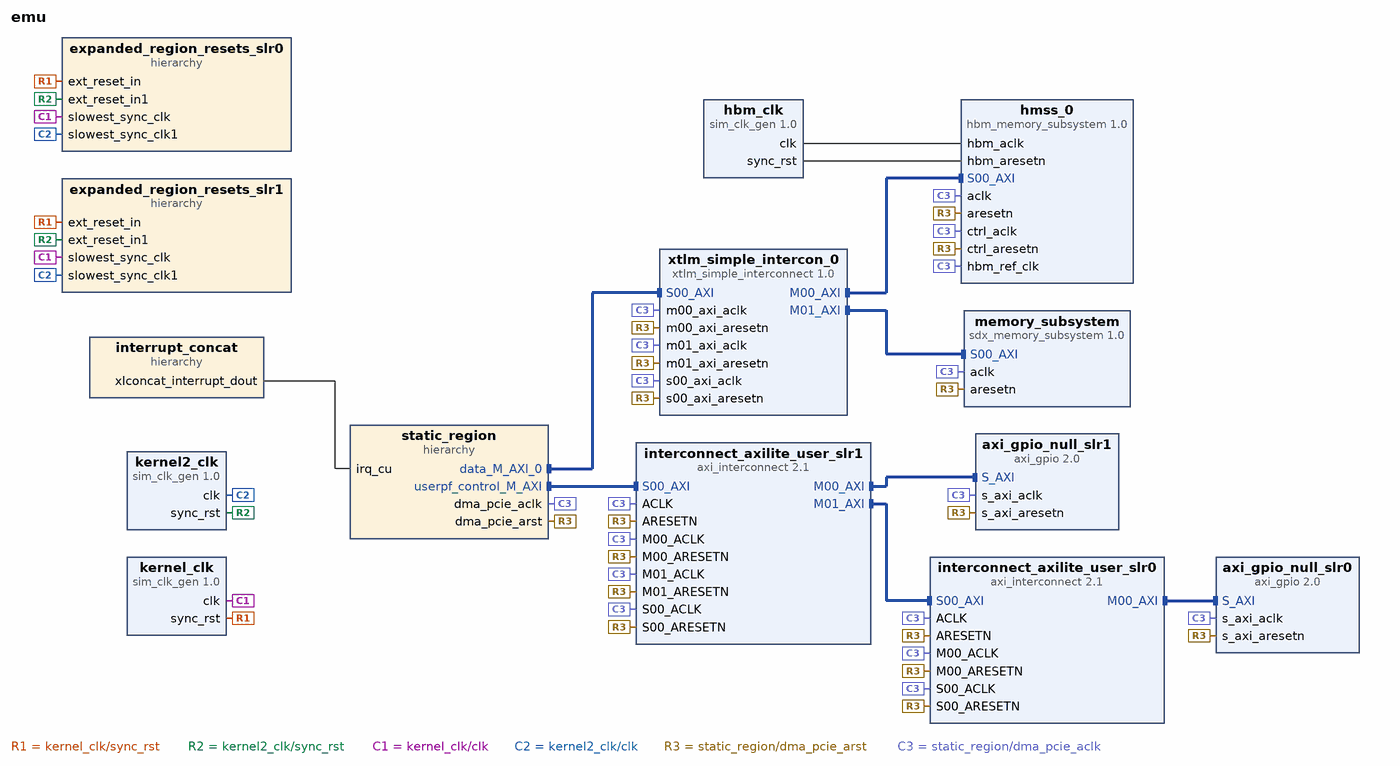
[diagram p0: block diagram of the top level]
# Vivado block design emu, xcu50-fsvh2104-2-e, Vivado 2019.2.1
create_bd_design emu

create_bd_cell -type hier static_region
create_bd_cell -type ip -vlnv xilinx.com:ip:axi_interconnect:2.1 interconnect_axilite_user_slr0
set_property -dict [list \
  CONFIG.M01_HAS_REGSLICE 1 \
  CONFIG.NUM_MI 1 \
  CONFIG.NUM_SI 1 \
  CONFIG.SLR_ASSIGNMENTS SLR0 \
] [get_bd_cells interconnect_axilite_user_slr0]
create_bd_cell -type ip -vlnv xilinx.com:ip:axi_interconnect:2.1 interconnect_axilite_user_slr1
set_property -dict [list \
  CONFIG.M01_HAS_REGSLICE 1 \
  CONFIG.NUM_MI 2 \
  CONFIG.NUM_SI 1 \
  CONFIG.SLR_ASSIGNMENTS SLR1 \
] [get_bd_cells interconnect_axilite_user_slr1]
create_bd_cell -type ip -vlnv xilinx.com:ip:sim_clk_gen:1.0 kernel2_clk
set_property -dict {CONFIG.FREQ_HZ 500000000} [get_bd_cells kernel2_clk]
create_bd_cell -type ip -vlnv xilinx.com:ip:sim_clk_gen:1.0 kernel_clk
set_property -dict {CONFIG.FREQ_HZ 300000000} [get_bd_cells kernel_clk]
create_bd_cell -type hier expanded_region_resets_slr0
create_bd_cell -type hier expanded_region_resets_slr1
create_bd_cell -type ip -vlnv xilinx.com:ip:axi_gpio:2.0 axi_gpio_null_slr0
create_bd_cell -type ip -vlnv xilinx.com:ip:axi_gpio:2.0 axi_gpio_null_slr1
create_bd_cell -type ip -vlnv xilinx.com:xilinx:xtlm_simple_interconnect:1.0 xtlm_simple_intercon_0
set_property -dict [list \
  CONFIG.C_ADDR_RANGES 1 \
  CONFIG.C_M00_A00_ADDR_RANGE 0x0000000200000000 \
  CONFIG.C_M00_A00_BASE_ADDRESS 0x0000000000000000 \
  CONFIG.C_M00_AXI_ADDR_WIDTH 64 \
  CONFIG.C_M01_A00_ADDR_RANGE 0x0000000002000000 \
  CONFIG.C_M01_A00_BASE_ADDRESS 0x0000000200000000 \
  CONFIG.C_M01_AXI_ADDR_WIDTH 64 \
  CONFIG.C_M01_AXI_DATA_WIDTH 32 \
  CONFIG.C_NUM_MI 2 \
  CONFIG.C_S00_AXI_ADDR_WIDTH 64 \
  CONFIG.C_S00_AXI_DATA_WIDTH 32 \
] [get_bd_cells xtlm_simple_intercon_0]
create_bd_cell -type ip -vlnv xilinx.com:ip:sdx_memory_subsystem:1.0 memory_subsystem
set_property -dict [list \
  CONFIG.ADVANCED_PROPERTIES {resource_map_replication {S00_AXI {}} resource_access_constraints {S00_AXI {PLRAM_MEM00 PLRAM_MEM01 PLRAM_MEM02 PLRAM_MEM03}} plram_specifications {{ SIZE 128K AXI_DATA_WIDTH 512 SLR_ASSIGNMENT SLR0 } { SIZE 128K AXI_DATA_WIDTH 512 SLR_ASSIGNMENT SLR0 } { SIZE 128K AXI_DATA_WIDTH 512 SLR_ASSIGNMENT SLR1 } { SIZE 128K AXI_DATA_WIDTH 512 SLR_ASSIGNMENT SLR1 }} __temp_dsa_info {excluded_board_components {} axi_passthrough {} sim_props {plram_0 {offset 0x200000000 range 0x20000 slr SLR0 passthrough no} plram_1 {offset 0x200400000 range 0x20000 slr SLR0 passthrough no} plram_2 {offset 0x201000000 range 0x20000 slr SLR1 passthrough no} plram_3 {offset 0x201400000 range 0x20000 slr SLR1 passthrough no}}}} \
  CONFIG.NUM_CLKS 1 \
  CONFIG.NUM_SI 1 \
] [get_bd_cells memory_subsystem]
create_bd_cell -type ip -vlnv xilinx.com:ip:sim_clk_gen:1.0 hbm_clk
set_property -dict {CONFIG.FREQ_HZ 450} [get_bd_cells hbm_clk]
create_bd_cell -type ip -vlnv xilinx.com:ip:hbm_memory_subsystem:1.0 hmss_0
set_property -dict {CONFIG.S00_SLR SLR0 CONFIG.SIM_EN true} [get_bd_cells hmss_0]
create_bd_cell -type hier interrupt_concat

# ---- hierarchy /static_region ----
current_bd_instance /static_region
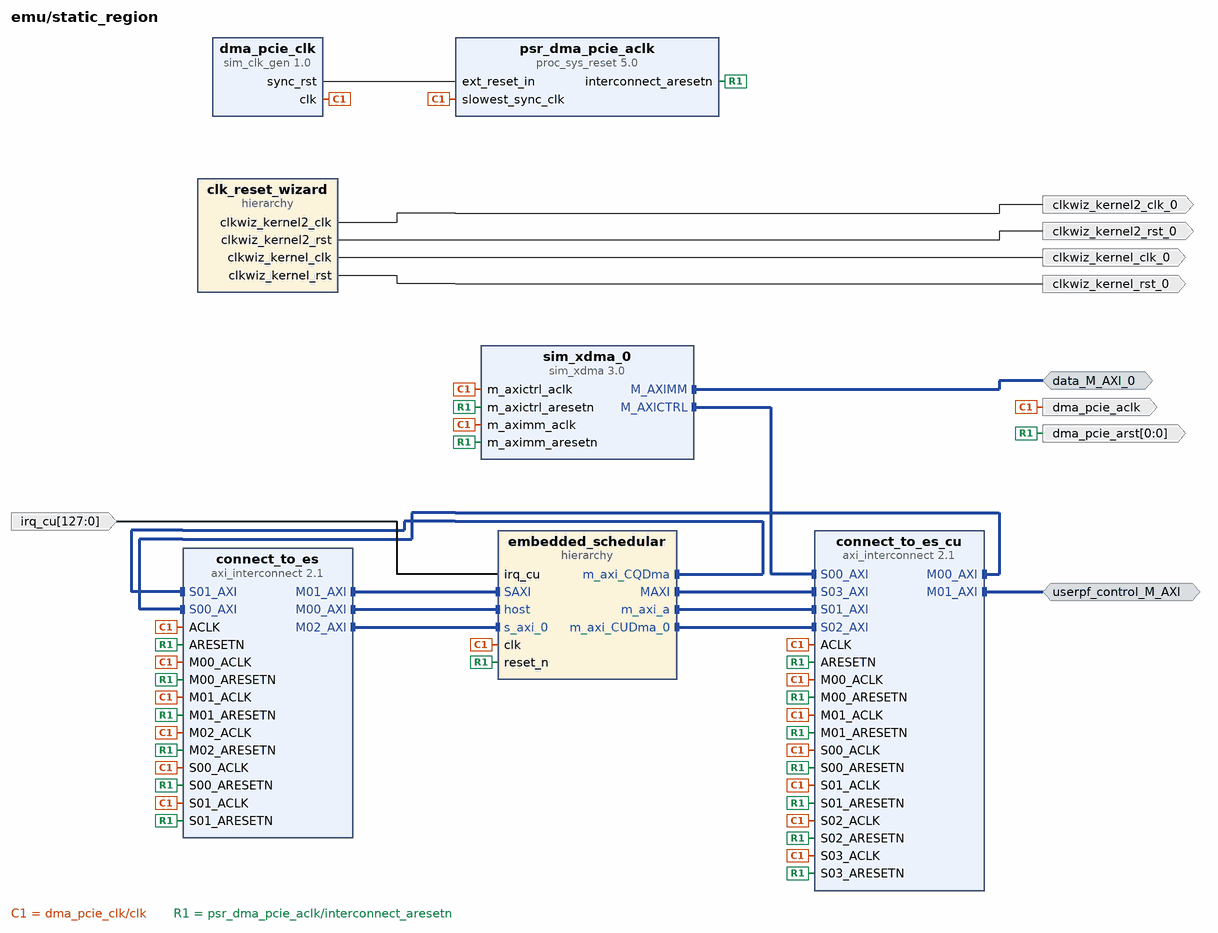
[diagram p1: block diagram inside /static_region]
create_bd_intf_pin -mode Master -vlnv xilinx.com:interface:aximm_rtl:1.0 data_M_AXI_0
create_bd_intf_pin -mode Master -vlnv xilinx.com:interface:aximm_rtl:1.0 userpf_control_M_AXI
create_bd_pin -dir O -type clk clkwiz_kernel2_clk_0
create_bd_pin -dir O -type clk clkwiz_kernel_clk_0
create_bd_pin -dir O -type rst clkwiz_kernel2_rst_0
create_bd_pin -dir O -type rst clkwiz_kernel_rst_0
create_bd_pin -dir O -type clk dma_pcie_aclk
create_bd_pin -dir I -from 127 -to 0 irq_cu
create_bd_pin -dir O -from 0 -to 0 -type rst dma_pcie_arst

create_bd_cell -type hier clk_reset_wizard
create_bd_cell -type ip -vlnv xilinx.com:ip:axi_interconnect:2.1 connect_to_es
set_property -dict {CONFIG.NUM_MI 3 CONFIG.NUM_SI 2} [get_bd_cells connect_to_es]
create_bd_cell -type ip -vlnv xilinx.com:ip:axi_interconnect:2.1 connect_to_es_cu
set_property -dict {CONFIG.NUM_MI 2 CONFIG.NUM_SI 4} [get_bd_cells connect_to_es_cu]
create_bd_cell -type ip -vlnv xilinx.com:ip:sim_clk_gen:1.0 dma_pcie_clk
set_property -dict {CONFIG.FREQ_HZ 300000000.0} [get_bd_cells dma_pcie_clk]
create_bd_cell -type hier embedded_schedular
create_bd_cell -type ip -vlnv xilinx.com:ip:proc_sys_reset:5.0 psr_dma_pcie_aclk
create_bd_cell -type ip -vlnv xilinx.com:xilinx:sim_xdma:3.0 sim_xdma_0
set_property -dict [list \
  CONFIG.C_M_AXICTRL_ADDR_WIDTH 64 \
  CONFIG.C_M_AXICTRL_DATA_WIDTH 32 \
  CONFIG.C_M_AXIMM_ADDR_WIDTH 64 \
  CONFIG.C_M_AXIMM_ARUSER_WIDTH 32 \
  CONFIG.C_M_AXIMM_AWUSER_WIDTH 32 \
  CONFIG.C_M_AXIMM_DATA_WIDTH 32 \
] [get_bd_cells sim_xdma_0]

# ---- hierarchy /static_region/clk_reset_wizard ----
current_bd_instance /static_region/clk_reset_wizard
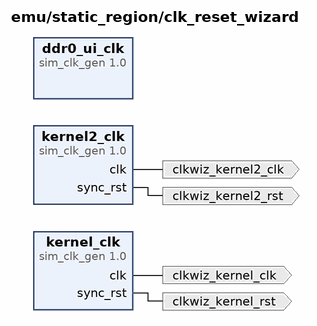
[diagram p2: block diagram inside /static_region/clk_reset_wizard]
create_bd_pin -dir O -type rst clkwiz_kernel2_rst
create_bd_pin -dir O -type rst clkwiz_kernel_rst
create_bd_pin -dir O -type clk clkwiz_kernel2_clk
create_bd_pin -dir O -type clk clkwiz_kernel_clk

create_bd_cell -type ip -vlnv xilinx.com:ip:sim_clk_gen:1.0 ddr0_ui_clk
set_property -dict {CONFIG.FREQ_HZ 300120048} [get_bd_cells ddr0_ui_clk]
create_bd_cell -type ip -vlnv xilinx.com:ip:sim_clk_gen:1.0 kernel2_clk
set_property -dict {CONFIG.FREQ_HZ 500000000} [get_bd_cells kernel2_clk]
create_bd_cell -type ip -vlnv xilinx.com:ip:sim_clk_gen:1.0 kernel_clk
set_property -dict {CONFIG.FREQ_HZ 300000000} [get_bd_cells kernel_clk]

# ---- hierarchy /static_region/embedded_schedular ----
current_bd_instance /static_region/embedded_schedular
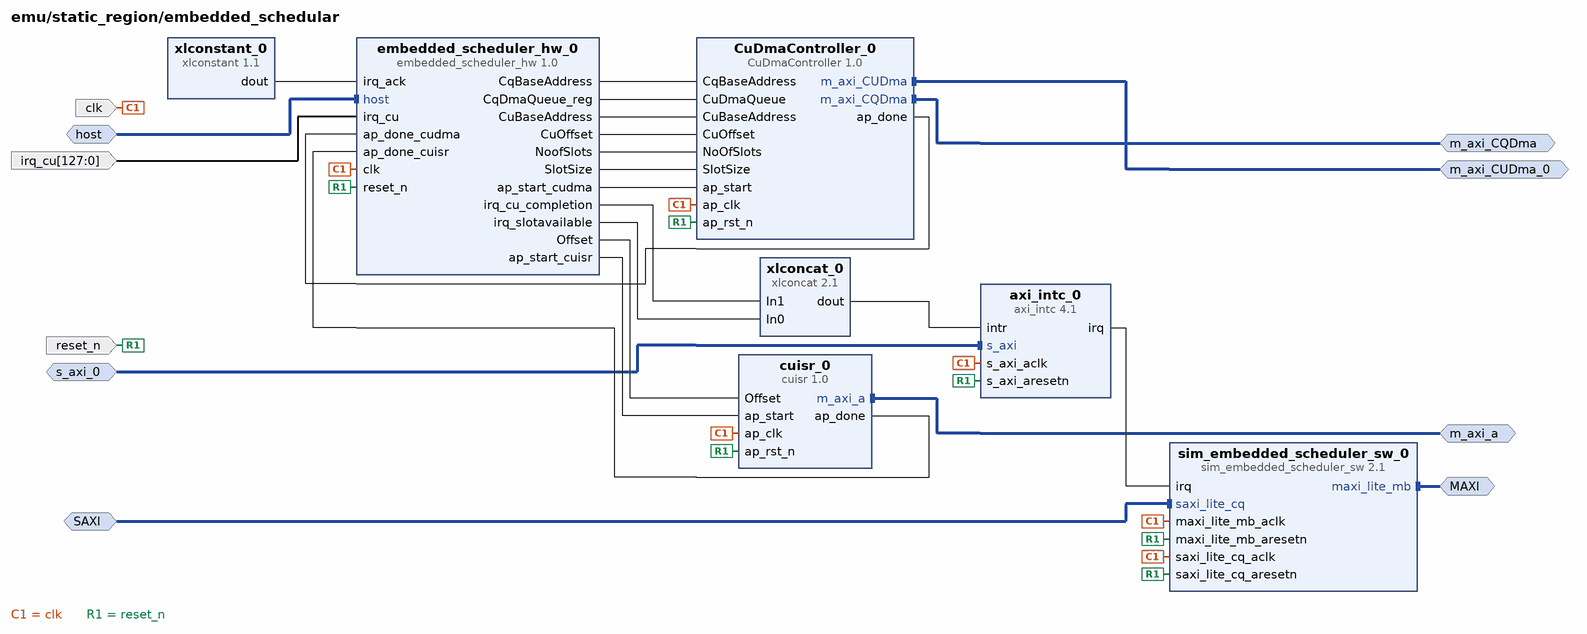
[diagram p3: block diagram inside /static_region/embedded_schedular]
create_bd_intf_pin -mode Master -vlnv xilinx.com:interface:aximm_rtl:1.0 MAXI
create_bd_intf_pin -mode Slave -vlnv xilinx.com:interface:aximm_rtl:1.0 SAXI
create_bd_intf_pin -mode Slave -vlnv xilinx.com:interface:aximm_rtl:1.0 host
create_bd_intf_pin -mode Master -vlnv xilinx.com:interface:aximm_rtl:1.0 m_axi_CQDma
create_bd_intf_pin -mode Master -vlnv xilinx.com:interface:aximm_rtl:1.0 m_axi_CUDma_0
create_bd_intf_pin -mode Master -vlnv xilinx.com:interface:aximm_rtl:1.0 m_axi_a
create_bd_intf_pin -mode Slave -vlnv xilinx.com:interface:aximm_rtl:1.0 s_axi_0
create_bd_pin -dir I -type clk clk
create_bd_pin -dir I -from 127 -to 0 irq_cu
create_bd_pin -dir I -type rst reset_n

create_bd_cell -type ip -vlnv xilinx:hls:CuDmaController:1.0 CuDmaController_0
create_bd_cell -type ip -vlnv xilinx.com:ip:axi_intc:4.1 axi_intc_0
set_property -dict [list \
  CONFIG.C_HAS_FAST 0 \
  CONFIG.C_IRQ_ACTIVE 1 \
  CONFIG.C_IRQ_IS_LEVEL 1 \
  CONFIG.C_KIND_OF_INTR 0xFFFFFFFC \
  CONFIG.C_KIND_OF_LVL 0xFFFFFFFF \
] [get_bd_cells axi_intc_0]
create_bd_cell -type ip -vlnv xilinx:hls:cuisr:1.0 cuisr_0
create_bd_cell -type ip -vlnv xilinx.com:user:embedded_scheduler_hw:1.0 embedded_scheduler_hw_0
create_bd_cell -type ip -vlnv xilinx.com:xilinx:sim_embedded_scheduler_sw:2.1 sim_embedded_scheduler_sw_0
create_bd_cell -type ip -vlnv xilinx.com:ip:xlconcat:2.1 xlconcat_0
create_bd_cell -type ip -vlnv xilinx.com:ip:xlconstant:1.1 xlconstant_0
set_property -dict {CONFIG.CONST_VAL 0 CONFIG.CONST_WIDTH 16} [get_bd_cells xlconstant_0]

# ---- hierarchy /expanded_region_resets_slr0 ----
current_bd_instance /expanded_region_resets_slr0
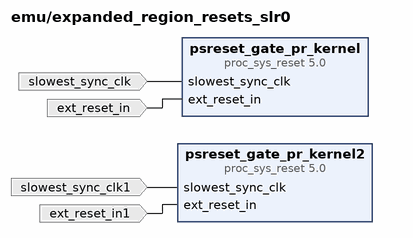
[diagram p4: block diagram inside /expanded_region_resets_slr0]
create_bd_pin -dir I -type clk slowest_sync_clk
create_bd_pin -dir I -type rst ext_reset_in
create_bd_pin -dir I -type clk slowest_sync_clk1
create_bd_pin -dir I -type rst ext_reset_in1

create_bd_cell -type ip -vlnv xilinx.com:ip:proc_sys_reset:5.0 psreset_gate_pr_kernel
set_property -dict {CONFIG.SLR_ASSIGNMENTS SLR0} [get_bd_cells psreset_gate_pr_kernel]
create_bd_cell -type ip -vlnv xilinx.com:ip:proc_sys_reset:5.0 psreset_gate_pr_kernel2
set_property -dict {CONFIG.SLR_ASSIGNMENTS SLR0} [get_bd_cells psreset_gate_pr_kernel2]

# ---- hierarchy /expanded_region_resets_slr1 ----
current_bd_instance /expanded_region_resets_slr1
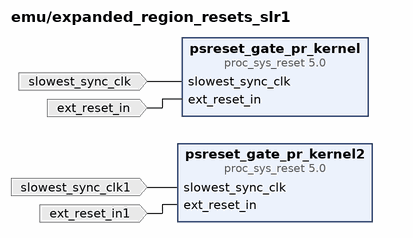
[diagram p5: block diagram inside /expanded_region_resets_slr1]
create_bd_pin -dir I -type clk slowest_sync_clk
create_bd_pin -dir I -type rst ext_reset_in
create_bd_pin -dir I -type clk slowest_sync_clk1
create_bd_pin -dir I -type rst ext_reset_in1

create_bd_cell -type ip -vlnv xilinx.com:ip:proc_sys_reset:5.0 psreset_gate_pr_kernel
set_property -dict {CONFIG.SLR_ASSIGNMENTS SLR1} [get_bd_cells psreset_gate_pr_kernel]
create_bd_cell -type ip -vlnv xilinx.com:ip:proc_sys_reset:5.0 psreset_gate_pr_kernel2
set_property -dict {CONFIG.SLR_ASSIGNMENTS SLR1} [get_bd_cells psreset_gate_pr_kernel2]

# ---- hierarchy /interrupt_concat ----
current_bd_instance /interrupt_concat
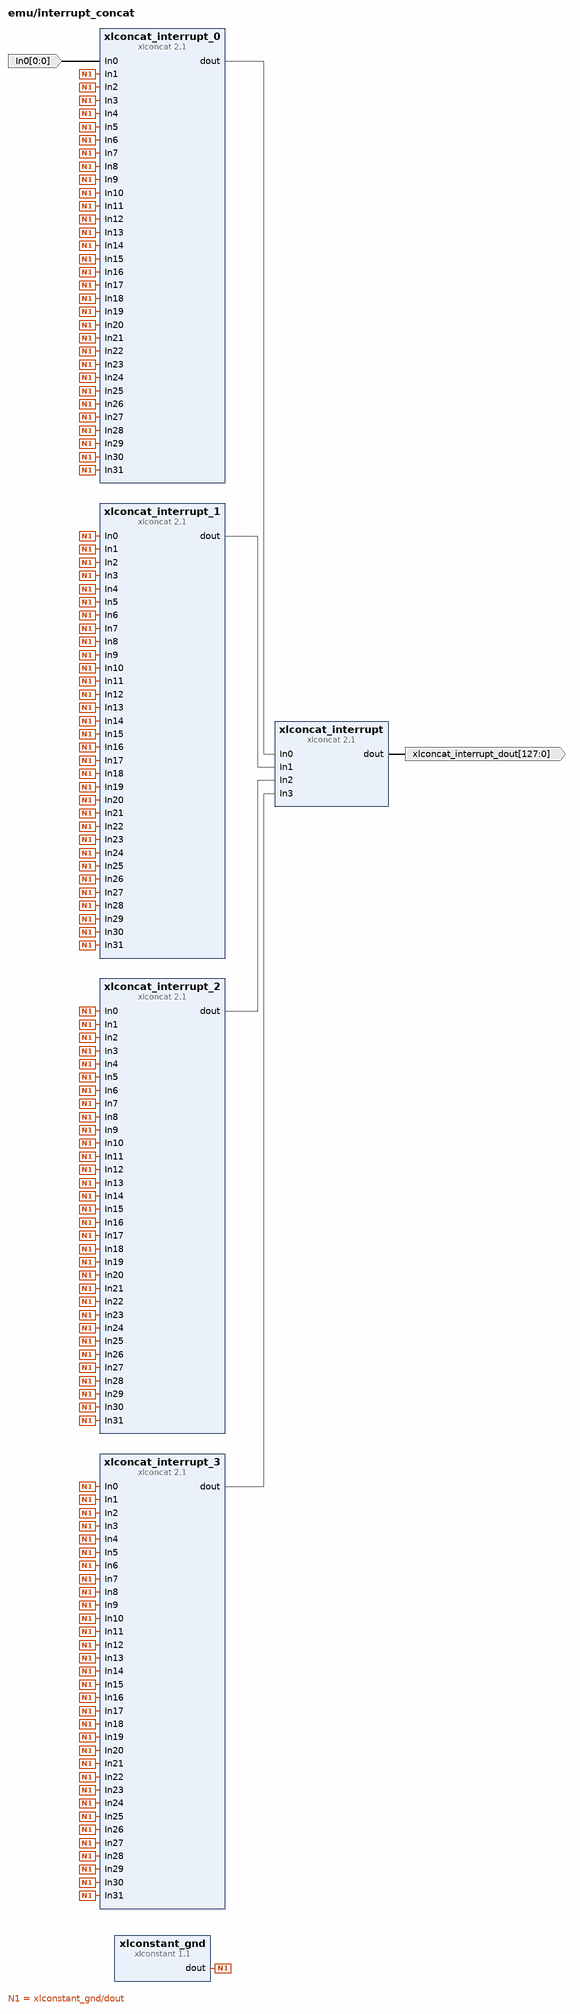
[diagram p6: block diagram inside /interrupt_concat]
create_bd_pin -dir I -from 0 -to 0 In0
create_bd_pin -dir O -from 127 -to 0 xlconcat_interrupt_dout

create_bd_cell -type ip -vlnv xilinx.com:ip:xlconcat:2.1 xlconcat_interrupt
set_property -dict {CONFIG.NUM_PORTS 4} [get_bd_cells xlconcat_interrupt]
create_bd_cell -type ip -vlnv xilinx.com:ip:xlconcat:2.1 xlconcat_interrupt_0
set_property -dict {CONFIG.NUM_PORTS 32} [get_bd_cells xlconcat_interrupt_0]
create_bd_cell -type ip -vlnv xilinx.com:ip:xlconcat:2.1 xlconcat_interrupt_1
set_property -dict {CONFIG.NUM_PORTS 32} [get_bd_cells xlconcat_interrupt_1]
create_bd_cell -type ip -vlnv xilinx.com:ip:xlconcat:2.1 xlconcat_interrupt_2
set_property -dict {CONFIG.NUM_PORTS 32} [get_bd_cells xlconcat_interrupt_2]
create_bd_cell -type ip -vlnv xilinx.com:ip:xlconcat:2.1 xlconcat_interrupt_3
set_property -dict {CONFIG.NUM_PORTS 32} [get_bd_cells xlconcat_interrupt_3]
create_bd_cell -type ip -vlnv xilinx.com:ip:xlconstant:1.1 xlconstant_gnd
set_property -dict {CONFIG.CONST_VAL 0} [get_bd_cells xlconstant_gnd]

# ---- connections ----

current_bd_instance /static_region
connect_bd_intf_net [get_bd_intf_pins connect_to_es/M01_AXI] [get_bd_intf_pins embedded_schedular/SAXI]
connect_bd_intf_net [get_bd_intf_pins connect_to_es_cu/S03_AXI] [get_bd_intf_pins embedded_schedular/MAXI]
connect_bd_intf_net [get_bd_intf_pins connect_to_es/S01_AXI] [get_bd_intf_pins embedded_schedular/m_axi_CQDma]
connect_bd_intf_net [get_bd_intf_pins userpf_control_M_AXI] [get_bd_intf_pins connect_to_es_cu/M01_AXI]
connect_bd_intf_net [get_bd_intf_pins connect_to_es_cu/S01_AXI] [get_bd_intf_pins embedded_schedular/m_axi_a]
connect_bd_intf_net [get_bd_intf_pins connect_to_es_cu/S00_AXI] [get_bd_intf_pins sim_xdma_0/M_AXICTRL]
connect_bd_intf_net [get_bd_intf_pins connect_to_es/M00_AXI] [get_bd_intf_pins embedded_schedular/host]
connect_bd_intf_net [get_bd_intf_pins connect_to_es/M02_AXI] [get_bd_intf_pins embedded_schedular/s_axi_0]
connect_bd_intf_net -intf_net data_M_AXI_0_1_conn [get_bd_intf_pins data_M_AXI_0] [get_bd_intf_pins sim_xdma_0/M_AXIMM]
connect_bd_intf_net [get_bd_intf_pins connect_to_es/S00_AXI] [get_bd_intf_pins connect_to_es_cu/M00_AXI]
connect_bd_intf_net [get_bd_intf_pins connect_to_es_cu/S02_AXI] [get_bd_intf_pins embedded_schedular/m_axi_CUDma_0]
connect_bd_net [get_bd_pins clk_reset_wizard/clkwiz_kernel2_clk] [get_bd_pins clkwiz_kernel2_clk_0]
connect_bd_net [get_bd_pins clk_reset_wizard/clkwiz_kernel_clk] [get_bd_pins clkwiz_kernel_clk_0]
connect_bd_net [get_bd_pins clk_reset_wizard/clkwiz_kernel2_rst] [get_bd_pins clkwiz_kernel2_rst_0]
connect_bd_net [get_bd_pins clk_reset_wizard/clkwiz_kernel_rst] [get_bd_pins clkwiz_kernel_rst_0]
connect_bd_net -net pcie_dma_aclk [get_bd_pins dma_pcie_clk/clk] \
  [get_bd_pins dma_pcie_aclk] [get_bd_pins connect_to_es/ACLK] [get_bd_pins connect_to_es/M00_ACLK] \
  [get_bd_pins connect_to_es/M01_ACLK] [get_bd_pins connect_to_es/M02_ACLK] [get_bd_pins connect_to_es/S00_ACLK] \
  [get_bd_pins connect_to_es/S01_ACLK] [get_bd_pins connect_to_es_cu/ACLK] [get_bd_pins connect_to_es_cu/M00_ACLK] \
  [get_bd_pins connect_to_es_cu/M01_ACLK] [get_bd_pins connect_to_es_cu/S00_ACLK] [get_bd_pins connect_to_es_cu/S01_ACLK] \
  [get_bd_pins connect_to_es_cu/S02_ACLK] [get_bd_pins connect_to_es_cu/S03_ACLK] [get_bd_pins embedded_schedular/clk] \
  [get_bd_pins psr_dma_pcie_aclk/slowest_sync_clk] [get_bd_pins sim_xdma_0/m_axictrl_aclk] \
  [get_bd_pins sim_xdma_0/m_aximm_aclk]
connect_bd_net -net pcie_dma [get_bd_pins dma_pcie_clk/sync_rst] [get_bd_pins psr_dma_pcie_aclk/ext_reset_in]
connect_bd_net [get_bd_pins irq_cu] [get_bd_pins embedded_schedular/irq_cu]
connect_bd_net -net psr_dma_pcie_aclk_mb_reset [get_bd_pins psr_dma_pcie_aclk/interconnect_aresetn] \
  [get_bd_pins dma_pcie_arst] [get_bd_pins connect_to_es/ARESETN] [get_bd_pins connect_to_es/M00_ARESETN] \
  [get_bd_pins connect_to_es/M01_ARESETN] [get_bd_pins connect_to_es/M02_ARESETN] [get_bd_pins connect_to_es/S00_ARESETN] \
  [get_bd_pins connect_to_es/S01_ARESETN] [get_bd_pins connect_to_es_cu/ARESETN] [get_bd_pins connect_to_es_cu/M00_ARESETN] \
  [get_bd_pins connect_to_es_cu/M01_ARESETN] [get_bd_pins connect_to_es_cu/S00_ARESETN] \
  [get_bd_pins connect_to_es_cu/S01_ARESETN] [get_bd_pins connect_to_es_cu/S02_ARESETN] \
  [get_bd_pins connect_to_es_cu/S03_ARESETN] [get_bd_pins embedded_schedular/reset_n] \
  [get_bd_pins sim_xdma_0/m_axictrl_aresetn] [get_bd_pins sim_xdma_0/m_aximm_aresetn]

current_bd_instance /static_region/clk_reset_wizard
connect_bd_net [get_bd_pins kernel2_clk/sync_rst] [get_bd_pins clkwiz_kernel2_rst]
connect_bd_net [get_bd_pins kernel_clk/sync_rst] [get_bd_pins clkwiz_kernel_rst]
connect_bd_net [get_bd_pins kernel_clk/clk] [get_bd_pins clkwiz_kernel_clk]
connect_bd_net [get_bd_pins kernel2_clk/clk] [get_bd_pins clkwiz_kernel2_clk]

current_bd_instance /static_region/embedded_schedular
connect_bd_intf_net [get_bd_intf_pins MAXI] [get_bd_intf_pins sim_embedded_scheduler_sw_0/maxi_lite_mb]
connect_bd_intf_net [get_bd_intf_pins m_axi_a] [get_bd_intf_pins cuisr_0/m_axi_a]
connect_bd_intf_net [get_bd_intf_pins SAXI] [get_bd_intf_pins sim_embedded_scheduler_sw_0/saxi_lite_cq]
connect_bd_intf_net [get_bd_intf_pins m_axi_CUDma_0] [get_bd_intf_pins CuDmaController_0/m_axi_CUDma]
connect_bd_intf_net -intf_net S01_AXI_1 [get_bd_intf_pins m_axi_CQDma] [get_bd_intf_pins CuDmaController_0/m_axi_CQDma]
connect_bd_intf_net [get_bd_intf_pins s_axi_0] [get_bd_intf_pins axi_intc_0/s_axi]
connect_bd_intf_net -intf_net axi_interconnect_0_M00_AXI [get_bd_intf_pins host] [get_bd_intf_pins embedded_scheduler_hw_0/host]
connect_bd_net [get_bd_pins CuDmaController_0/ap_done] [get_bd_pins embedded_scheduler_hw_0/ap_done_cudma]
connect_bd_net [get_bd_pins axi_intc_0/irq] [get_bd_pins sim_embedded_scheduler_sw_0/irq]
connect_bd_net [get_bd_pins cuisr_0/ap_done] [get_bd_pins embedded_scheduler_hw_0/ap_done_cuisr]
connect_bd_net -net dma_pcie_aclk_clk [get_bd_pins clk] \
  [get_bd_pins CuDmaController_0/ap_clk] [get_bd_pins axi_intc_0/s_axi_aclk] [get_bd_pins cuisr_0/ap_clk] \
  [get_bd_pins embedded_scheduler_hw_0/clk] [get_bd_pins sim_embedded_scheduler_sw_0/maxi_lite_mb_aclk] \
  [get_bd_pins sim_embedded_scheduler_sw_0/saxi_lite_cq_aclk]
connect_bd_net -net dma_pcie_aclk_sync_rst [get_bd_pins reset_n] \
  [get_bd_pins CuDmaController_0/ap_rst_n] [get_bd_pins axi_intc_0/s_axi_aresetn] [get_bd_pins cuisr_0/ap_rst_n] \
  [get_bd_pins embedded_scheduler_hw_0/reset_n] [get_bd_pins sim_embedded_scheduler_sw_0/maxi_lite_mb_aresetn] \
  [get_bd_pins sim_embedded_scheduler_sw_0/saxi_lite_cq_aresetn]
connect_bd_net [get_bd_pins embedded_scheduler_hw_0/CqBaseAddress] [get_bd_pins CuDmaController_0/CqBaseAddress]
connect_bd_net [get_bd_pins embedded_scheduler_hw_0/CqDmaQueue_reg] [get_bd_pins CuDmaController_0/CuDmaQueue]
connect_bd_net [get_bd_pins embedded_scheduler_hw_0/CuBaseAddress] [get_bd_pins CuDmaController_0/CuBaseAddress]
connect_bd_net [get_bd_pins embedded_scheduler_hw_0/CuOffset] [get_bd_pins CuDmaController_0/CuOffset]
connect_bd_net [get_bd_pins embedded_scheduler_hw_0/NoofSlots] [get_bd_pins CuDmaController_0/NoOfSlots]
connect_bd_net [get_bd_pins embedded_scheduler_hw_0/SlotSize] [get_bd_pins CuDmaController_0/SlotSize]
connect_bd_net -net embedded_scheduler_hw_0_ap_offset_cuisr [get_bd_pins embedded_scheduler_hw_0/Offset] [get_bd_pins cuisr_0/Offset]
connect_bd_net [get_bd_pins embedded_scheduler_hw_0/ap_start_cudma] [get_bd_pins CuDmaController_0/ap_start]
connect_bd_net [get_bd_pins embedded_scheduler_hw_0/ap_start_cuisr] [get_bd_pins cuisr_0/ap_start]
connect_bd_net [get_bd_pins embedded_scheduler_hw_0/irq_cu_completion] [get_bd_pins xlconcat_0/In1]
connect_bd_net [get_bd_pins embedded_scheduler_hw_0/irq_slotavailable] [get_bd_pins xlconcat_0/In0]
connect_bd_net [get_bd_pins irq_cu] [get_bd_pins embedded_scheduler_hw_0/irq_cu]
connect_bd_net [get_bd_pins xlconcat_0/dout] [get_bd_pins axi_intc_0/intr]
connect_bd_net [get_bd_pins xlconstant_0/dout] [get_bd_pins embedded_scheduler_hw_0/irq_ack]

current_bd_instance /expanded_region_resets_slr0
connect_bd_net -net slowest_sync_clk_0_1 [get_bd_pins slowest_sync_clk] [get_bd_pins psreset_gate_pr_kernel/slowest_sync_clk]
connect_bd_net -net ext_reset_in_0_1 [get_bd_pins ext_reset_in] [get_bd_pins psreset_gate_pr_kernel/ext_reset_in]
connect_bd_net -net slowest_sync_clk_2_1 [get_bd_pins slowest_sync_clk1] [get_bd_pins psreset_gate_pr_kernel2/slowest_sync_clk]
connect_bd_net -net ext_reset_in_2_1 [get_bd_pins ext_reset_in1] [get_bd_pins psreset_gate_pr_kernel2/ext_reset_in]

current_bd_instance /expanded_region_resets_slr1
connect_bd_net -net slowest_sync_clk_0_1 [get_bd_pins slowest_sync_clk] [get_bd_pins psreset_gate_pr_kernel/slowest_sync_clk]
connect_bd_net -net ext_reset_in_0_1 [get_bd_pins ext_reset_in] [get_bd_pins psreset_gate_pr_kernel/ext_reset_in]
connect_bd_net -net slowest_sync_clk_2_1 [get_bd_pins slowest_sync_clk1] [get_bd_pins psreset_gate_pr_kernel2/slowest_sync_clk]
connect_bd_net -net ext_reset_in_2_1 [get_bd_pins ext_reset_in1] [get_bd_pins psreset_gate_pr_kernel2/ext_reset_in]

current_bd_instance /interrupt_concat
connect_bd_net -net In0_1 [get_bd_pins In0] [get_bd_pins xlconcat_interrupt_0/In0]
connect_bd_net [get_bd_pins xlconcat_interrupt_0/dout] [get_bd_pins xlconcat_interrupt/In0]
connect_bd_net [get_bd_pins xlconcat_interrupt_1/dout] [get_bd_pins xlconcat_interrupt/In1]
connect_bd_net [get_bd_pins xlconcat_interrupt_2/dout] [get_bd_pins xlconcat_interrupt/In2]
connect_bd_net [get_bd_pins xlconcat_interrupt_3/dout] [get_bd_pins xlconcat_interrupt/In3]
connect_bd_net [get_bd_pins xlconcat_interrupt/dout] [get_bd_pins xlconcat_interrupt_dout]
connect_bd_net [get_bd_pins xlconstant_gnd/dout] \
  [get_bd_pins xlconcat_interrupt_0/In1] [get_bd_pins xlconcat_interrupt_0/In2] [get_bd_pins xlconcat_interrupt_0/In3] \
  [get_bd_pins xlconcat_interrupt_0/In4] [get_bd_pins xlconcat_interrupt_0/In5] [get_bd_pins xlconcat_interrupt_0/In6] \
  [get_bd_pins xlconcat_interrupt_0/In7] [get_bd_pins xlconcat_interrupt_0/In8] [get_bd_pins xlconcat_interrupt_0/In9] \
  [get_bd_pins xlconcat_interrupt_0/In10] [get_bd_pins xlconcat_interrupt_0/In11] [get_bd_pins xlconcat_interrupt_0/In12] \
  [get_bd_pins xlconcat_interrupt_0/In13] [get_bd_pins xlconcat_interrupt_0/In14] [get_bd_pins xlconcat_interrupt_0/In15] \
  [get_bd_pins xlconcat_interrupt_0/In16] [get_bd_pins xlconcat_interrupt_0/In17] [get_bd_pins xlconcat_interrupt_0/In18] \
  [get_bd_pins xlconcat_interrupt_0/In19] [get_bd_pins xlconcat_interrupt_0/In20] [get_bd_pins xlconcat_interrupt_0/In21] \
  [get_bd_pins xlconcat_interrupt_0/In22] [get_bd_pins xlconcat_interrupt_0/In23] [get_bd_pins xlconcat_interrupt_0/In24] \
  [get_bd_pins xlconcat_interrupt_0/In25] [get_bd_pins xlconcat_interrupt_0/In26] [get_bd_pins xlconcat_interrupt_0/In27] \
  [get_bd_pins xlconcat_interrupt_0/In28] [get_bd_pins xlconcat_interrupt_0/In29] [get_bd_pins xlconcat_interrupt_0/In30] \
  [get_bd_pins xlconcat_interrupt_0/In31] [get_bd_pins xlconcat_interrupt_1/In0] [get_bd_pins xlconcat_interrupt_1/In1] \
  [get_bd_pins xlconcat_interrupt_1/In2] [get_bd_pins xlconcat_interrupt_1/In3] [get_bd_pins xlconcat_interrupt_1/In4] \
  [get_bd_pins xlconcat_interrupt_1/In5] [get_bd_pins xlconcat_interrupt_1/In6] [get_bd_pins xlconcat_interrupt_1/In7] \
  [get_bd_pins xlconcat_interrupt_1/In8] [get_bd_pins xlconcat_interrupt_1/In9] [get_bd_pins xlconcat_interrupt_1/In10] \
  [get_bd_pins xlconcat_interrupt_1/In11] [get_bd_pins xlconcat_interrupt_1/In12] [get_bd_pins xlconcat_interrupt_1/In13] \
  [get_bd_pins xlconcat_interrupt_1/In14] [get_bd_pins xlconcat_interrupt_1/In15] [get_bd_pins xlconcat_interrupt_1/In16] \
  [get_bd_pins xlconcat_interrupt_1/In17] [get_bd_pins xlconcat_interrupt_1/In18] [get_bd_pins xlconcat_interrupt_1/In19] \
  [get_bd_pins xlconcat_interrupt_1/In20] [get_bd_pins xlconcat_interrupt_1/In21] [get_bd_pins xlconcat_interrupt_1/In22] \
  [get_bd_pins xlconcat_interrupt_1/In23] [get_bd_pins xlconcat_interrupt_1/In24] [get_bd_pins xlconcat_interrupt_1/In25] \
  [get_bd_pins xlconcat_interrupt_1/In26] [get_bd_pins xlconcat_interrupt_1/In27] [get_bd_pins xlconcat_interrupt_1/In28] \
  [get_bd_pins xlconcat_interrupt_1/In29] [get_bd_pins xlconcat_interrupt_1/In30] [get_bd_pins xlconcat_interrupt_1/In31] \
  [get_bd_pins xlconcat_interrupt_2/In0] [get_bd_pins xlconcat_interrupt_2/In1] [get_bd_pins xlconcat_interrupt_2/In2] \
  [get_bd_pins xlconcat_interrupt_2/In3] [get_bd_pins xlconcat_interrupt_2/In4] [get_bd_pins xlconcat_interrupt_2/In5] \
  [get_bd_pins xlconcat_interrupt_2/In6] [get_bd_pins xlconcat_interrupt_2/In7] [get_bd_pins xlconcat_interrupt_2/In8] \
  [get_bd_pins xlconcat_interrupt_2/In9] [get_bd_pins xlconcat_interrupt_2/In10] [get_bd_pins xlconcat_interrupt_2/In11] \
  [get_bd_pins xlconcat_interrupt_2/In12] [get_bd_pins xlconcat_interrupt_2/In13] [get_bd_pins xlconcat_interrupt_2/In14] \
  [get_bd_pins xlconcat_interrupt_2/In15] [get_bd_pins xlconcat_interrupt_2/In16] [get_bd_pins xlconcat_interrupt_2/In17] \
  [get_bd_pins xlconcat_interrupt_2/In18] [get_bd_pins xlconcat_interrupt_2/In19] [get_bd_pins xlconcat_interrupt_2/In20] \
  [get_bd_pins xlconcat_interrupt_2/In21] [get_bd_pins xlconcat_interrupt_2/In22] [get_bd_pins xlconcat_interrupt_2/In23] \
  [get_bd_pins xlconcat_interrupt_2/In24] [get_bd_pins xlconcat_interrupt_2/In25] [get_bd_pins xlconcat_interrupt_2/In26] \
  [get_bd_pins xlconcat_interrupt_2/In27] [get_bd_pins xlconcat_interrupt_2/In28] [get_bd_pins xlconcat_interrupt_2/In29] \
  [get_bd_pins xlconcat_interrupt_2/In30] [get_bd_pins xlconcat_interrupt_2/In31] [get_bd_pins xlconcat_interrupt_3/In0] \
  [get_bd_pins xlconcat_interrupt_3/In1] [get_bd_pins xlconcat_interrupt_3/In2] [get_bd_pins xlconcat_interrupt_3/In3] \
  [get_bd_pins xlconcat_interrupt_3/In4] [get_bd_pins xlconcat_interrupt_3/In5] [get_bd_pins xlconcat_interrupt_3/In6] \
  [get_bd_pins xlconcat_interrupt_3/In7] [get_bd_pins xlconcat_interrupt_3/In8] [get_bd_pins xlconcat_interrupt_3/In9] \
  [get_bd_pins xlconcat_interrupt_3/In10] [get_bd_pins xlconcat_interrupt_3/In11] [get_bd_pins xlconcat_interrupt_3/In12] \
  [get_bd_pins xlconcat_interrupt_3/In13] [get_bd_pins xlconcat_interrupt_3/In14] [get_bd_pins xlconcat_interrupt_3/In15] \
  [get_bd_pins xlconcat_interrupt_3/In16] [get_bd_pins xlconcat_interrupt_3/In17] [get_bd_pins xlconcat_interrupt_3/In18] \
  [get_bd_pins xlconcat_interrupt_3/In19] [get_bd_pins xlconcat_interrupt_3/In20] [get_bd_pins xlconcat_interrupt_3/In21] \
  [get_bd_pins xlconcat_interrupt_3/In22] [get_bd_pins xlconcat_interrupt_3/In23] [get_bd_pins xlconcat_interrupt_3/In24] \
  [get_bd_pins xlconcat_interrupt_3/In25] [get_bd_pins xlconcat_interrupt_3/In26] [get_bd_pins xlconcat_interrupt_3/In27] \
  [get_bd_pins xlconcat_interrupt_3/In28] [get_bd_pins xlconcat_interrupt_3/In29] [get_bd_pins xlconcat_interrupt_3/In30] \
  [get_bd_pins xlconcat_interrupt_3/In31]

current_bd_instance /
connect_bd_intf_net -intf_net interconnect_axilite_0_M00_AXI [get_bd_intf_pins interconnect_axilite_user_slr0/M00_AXI] [get_bd_intf_pins axi_gpio_null_slr0/S_AXI]
connect_bd_intf_net -intf_net interconnect_axilite_1_M00_AXI [get_bd_intf_pins interconnect_axilite_user_slr1/M00_AXI] [get_bd_intf_pins axi_gpio_null_slr1/S_AXI]
connect_bd_intf_net [get_bd_intf_pins interconnect_axilite_user_slr0/S00_AXI] [get_bd_intf_pins interconnect_axilite_user_slr1/M01_AXI]
connect_bd_intf_net -intf_net hmss_s00_axi [get_bd_intf_pins hmss_0/S00_AXI] [get_bd_intf_pins xtlm_simple_intercon_0/M00_AXI]
connect_bd_intf_net [get_bd_intf_pins interconnect_axilite_user_slr1/S00_AXI] [get_bd_intf_pins static_region/userpf_control_M_AXI]
connect_bd_intf_net [get_bd_intf_pins xtlm_simple_intercon_0/S00_AXI] [get_bd_intf_pins static_region/data_M_AXI_0]
connect_bd_intf_net -intf_net xtlm_simple_intercon_0_M_AXI_1_AXI [get_bd_intf_pins memory_subsystem/S00_AXI] [get_bd_intf_pins xtlm_simple_intercon_0/M01_AXI]
connect_bd_net -net ext_reset_in_0_1 [get_bd_pins kernel_clk/sync_rst] \
  [get_bd_pins expanded_region_resets_slr0/ext_reset_in] [get_bd_pins expanded_region_resets_slr1/ext_reset_in]
connect_bd_net -net ext_reset_in_2_1 [get_bd_pins kernel2_clk/sync_rst] \
  [get_bd_pins expanded_region_resets_slr0/ext_reset_in1] [get_bd_pins expanded_region_resets_slr1/ext_reset_in1]
connect_bd_net -net slowest_sync_clk_0_1 [get_bd_pins kernel_clk/clk] \
  [get_bd_pins expanded_region_resets_slr0/slowest_sync_clk] [get_bd_pins expanded_region_resets_slr1/slowest_sync_clk]
connect_bd_net -net slowest_sync_clk_2_1 [get_bd_pins kernel2_clk/clk] \
  [get_bd_pins expanded_region_resets_slr0/slowest_sync_clk1] [get_bd_pins expanded_region_resets_slr1/slowest_sync_clk1]
connect_bd_net -net ext_reset_in_1_1 [get_bd_pins static_region/dma_pcie_arst] \
  [get_bd_pins xtlm_simple_intercon_0/s00_axi_aresetn] [get_bd_pins xtlm_simple_intercon_0/m00_axi_aresetn] \
  [get_bd_pins hmss_0/aresetn] [get_bd_pins interconnect_axilite_user_slr0/ARESETN] \
  [get_bd_pins interconnect_axilite_user_slr0/M00_ARESETN] [get_bd_pins interconnect_axilite_user_slr0/S00_ARESETN] \
  [get_bd_pins interconnect_axilite_user_slr1/ARESETN] [get_bd_pins interconnect_axilite_user_slr1/M00_ARESETN] \
  [get_bd_pins interconnect_axilite_user_slr1/M01_ARESETN] [get_bd_pins interconnect_axilite_user_slr1/S00_ARESETN] \
  [get_bd_pins axi_gpio_null_slr0/s_axi_aresetn] [get_bd_pins axi_gpio_null_slr1/s_axi_aresetn] \
  [get_bd_pins hmss_0/ctrl_aresetn] [get_bd_pins memory_subsystem/aresetn] \
  [get_bd_pins xtlm_simple_intercon_0/m01_axi_aresetn]
connect_bd_net -net slowest_sync_clk_1_1 [get_bd_pins static_region/dma_pcie_aclk] \
  [get_bd_pins xtlm_simple_intercon_0/s00_axi_aclk] [get_bd_pins xtlm_simple_intercon_0/m00_axi_aclk] \
  [get_bd_pins hmss_0/aclk] [get_bd_pins hmss_0/hbm_ref_clk] [get_bd_pins axi_gpio_null_slr0/s_axi_aclk] \
  [get_bd_pins axi_gpio_null_slr1/s_axi_aclk] [get_bd_pins interconnect_axilite_user_slr0/ACLK] \
  [get_bd_pins interconnect_axilite_user_slr0/M00_ACLK] [get_bd_pins interconnect_axilite_user_slr0/S00_ACLK] \
  [get_bd_pins interconnect_axilite_user_slr1/ACLK] [get_bd_pins interconnect_axilite_user_slr1/M00_ACLK] \
  [get_bd_pins interconnect_axilite_user_slr1/M01_ACLK] [get_bd_pins interconnect_axilite_user_slr1/S00_ACLK] \
  [get_bd_pins hmss_0/ctrl_aclk] [get_bd_pins memory_subsystem/aclk] [get_bd_pins xtlm_simple_intercon_0/m01_axi_aclk]
connect_bd_net -net hbm_aclk_net [get_bd_pins hbm_clk/clk] [get_bd_pins hmss_0/hbm_aclk]
connect_bd_net -net hbm_aresetn_net [get_bd_pins hbm_clk/sync_rst] [get_bd_pins hmss_0/hbm_aresetn]
connect_bd_net -net irq_cu_1 [get_bd_pins interrupt_concat/xlconcat_interrupt_dout] [get_bd_pins static_region/irq_cu]

# ---- address map ----
assign_bd_address -offset 0x00180000 -range 4K -target_address_space [get_bd_addr_spaces static_region/embedded_schedular/CuDmaController_0/Data_m_axi_CQDma] [get_bd_addr_segs static_region/embedded_schedular/embedded_scheduler_hw_0/host/reg0]
assign_bd_address -offset 0x00190000 -range 64K -target_address_space [get_bd_addr_spaces static_region/embedded_schedular/CuDmaController_0/Data_m_axi_CQDma] [get_bd_addr_segs static_region/embedded_schedular/sim_embedded_scheduler_sw_0/saxi_lite_cq/saxi_lite_cq_reg]
assign_bd_address -offset 0x41200000 -range 64K -target_address_space [get_bd_addr_spaces static_region/embedded_schedular/CuDmaController_0/Data_m_axi_CQDma] [get_bd_addr_segs static_region/embedded_schedular/axi_intc_0/S_AXI/Reg]
assign_bd_address -offset 0x00180000 -range 4K -target_address_space [get_bd_addr_spaces static_region/embedded_schedular/CuDmaController_0/Data_m_axi_CUDma] [get_bd_addr_segs static_region/embedded_schedular/embedded_scheduler_hw_0/host/reg0]
assign_bd_address -offset 0x00190000 -range 64K -target_address_space [get_bd_addr_spaces static_region/embedded_schedular/CuDmaController_0/Data_m_axi_CUDma] [get_bd_addr_segs static_region/embedded_schedular/sim_embedded_scheduler_sw_0/saxi_lite_cq/saxi_lite_cq_reg]
assign_bd_address -offset 0x41200000 -range 64K -target_address_space [get_bd_addr_spaces static_region/embedded_schedular/CuDmaController_0/Data_m_axi_CUDma] [get_bd_addr_segs static_region/embedded_schedular/axi_intc_0/S_AXI/Reg]
assign_bd_address -offset 0x00180000 -range 4K -target_address_space [get_bd_addr_spaces static_region/embedded_schedular/cuisr_0/Data_m_axi_a] [get_bd_addr_segs static_region/embedded_schedular/embedded_scheduler_hw_0/host/reg0]
assign_bd_address -offset 0x00190000 -range 64K -target_address_space [get_bd_addr_spaces static_region/embedded_schedular/cuisr_0/Data_m_axi_a] [get_bd_addr_segs static_region/embedded_schedular/sim_embedded_scheduler_sw_0/saxi_lite_cq/saxi_lite_cq_reg]
assign_bd_address -offset 0x41200000 -range 64K -target_address_space [get_bd_addr_spaces static_region/embedded_schedular/cuisr_0/Data_m_axi_a] [get_bd_addr_segs static_region/embedded_schedular/axi_intc_0/S_AXI/Reg]
assign_bd_address -offset 0x00180000 -range 4K -target_address_space [get_bd_addr_spaces static_region/embedded_schedular/sim_embedded_scheduler_sw_0/maxi_lite_mb] [get_bd_addr_segs static_region/embedded_schedular/embedded_scheduler_hw_0/host/reg0]
assign_bd_address -offset 0x00190000 -range 64K -target_address_space [get_bd_addr_spaces static_region/embedded_schedular/sim_embedded_scheduler_sw_0/maxi_lite_mb] [get_bd_addr_segs static_region/embedded_schedular/sim_embedded_scheduler_sw_0/saxi_lite_cq/saxi_lite_cq_reg]
assign_bd_address -offset 0x41200000 -range 64K -target_address_space [get_bd_addr_spaces static_region/embedded_schedular/sim_embedded_scheduler_sw_0/maxi_lite_mb] [get_bd_addr_segs static_region/embedded_schedular/axi_intc_0/S_AXI/Reg]
assign_bd_address -offset 0x0000000000180000 -range 4K -target_address_space [get_bd_addr_spaces static_region/sim_xdma_0/M_AXICTRL] [get_bd_addr_segs static_region/embedded_schedular/embedded_scheduler_hw_0/host/reg0]
assign_bd_address -offset 0x0000000000190000 -range 64K -target_address_space [get_bd_addr_spaces static_region/sim_xdma_0/M_AXICTRL] [get_bd_addr_segs static_region/embedded_schedular/sim_embedded_scheduler_sw_0/saxi_lite_cq/saxi_lite_cq_reg]
assign_bd_address -offset 0x0000000000000000 -range 256M -target_address_space [get_bd_addr_spaces static_region/sim_xdma_0/M_AXIMM] [get_bd_addr_segs hmss_0/S00_AXI/HBM_MEM00]
assign_bd_address -offset 0x0000000010000000 -range 256M -target_address_space [get_bd_addr_spaces static_region/sim_xdma_0/M_AXIMM] [get_bd_addr_segs hmss_0/S00_AXI/HBM_MEM01]
assign_bd_address -offset 0x0000000020000000 -range 256M -target_address_space [get_bd_addr_spaces static_region/sim_xdma_0/M_AXIMM] [get_bd_addr_segs hmss_0/S00_AXI/HBM_MEM02]
assign_bd_address -offset 0x0000000030000000 -range 256M -target_address_space [get_bd_addr_spaces static_region/sim_xdma_0/M_AXIMM] [get_bd_addr_segs hmss_0/S00_AXI/HBM_MEM03]
assign_bd_address -offset 0x0000000040000000 -range 256M -target_address_space [get_bd_addr_spaces static_region/sim_xdma_0/M_AXIMM] [get_bd_addr_segs hmss_0/S00_AXI/HBM_MEM04]
assign_bd_address -offset 0x0000000050000000 -range 256M -target_address_space [get_bd_addr_spaces static_region/sim_xdma_0/M_AXIMM] [get_bd_addr_segs hmss_0/S00_AXI/HBM_MEM05]
assign_bd_address -offset 0x0000000060000000 -range 256M -target_address_space [get_bd_addr_spaces static_region/sim_xdma_0/M_AXIMM] [get_bd_addr_segs hmss_0/S00_AXI/HBM_MEM06]
assign_bd_address -offset 0x0000000070000000 -range 256M -target_address_space [get_bd_addr_spaces static_region/sim_xdma_0/M_AXIMM] [get_bd_addr_segs hmss_0/S00_AXI/HBM_MEM07]
assign_bd_address -offset 0x0000000080000000 -range 256M -target_address_space [get_bd_addr_spaces static_region/sim_xdma_0/M_AXIMM] [get_bd_addr_segs hmss_0/S00_AXI/HBM_MEM08]
assign_bd_address -offset 0x0000000090000000 -range 256M -target_address_space [get_bd_addr_spaces static_region/sim_xdma_0/M_AXIMM] [get_bd_addr_segs hmss_0/S00_AXI/HBM_MEM09]
assign_bd_address -offset 0x00000000A0000000 -range 256M -target_address_space [get_bd_addr_spaces static_region/sim_xdma_0/M_AXIMM] [get_bd_addr_segs hmss_0/S00_AXI/HBM_MEM10]
assign_bd_address -offset 0x00000000B0000000 -range 256M -target_address_space [get_bd_addr_spaces static_region/sim_xdma_0/M_AXIMM] [get_bd_addr_segs hmss_0/S00_AXI/HBM_MEM11]
assign_bd_address -offset 0x00000000C0000000 -range 256M -target_address_space [get_bd_addr_spaces static_region/sim_xdma_0/M_AXIMM] [get_bd_addr_segs hmss_0/S00_AXI/HBM_MEM12]
assign_bd_address -offset 0x00000000D0000000 -range 256M -target_address_space [get_bd_addr_spaces static_region/sim_xdma_0/M_AXIMM] [get_bd_addr_segs hmss_0/S00_AXI/HBM_MEM13]
assign_bd_address -offset 0x00000000E0000000 -range 256M -target_address_space [get_bd_addr_spaces static_region/sim_xdma_0/M_AXIMM] [get_bd_addr_segs hmss_0/S00_AXI/HBM_MEM14]
assign_bd_address -offset 0x00000000F0000000 -range 256M -target_address_space [get_bd_addr_spaces static_region/sim_xdma_0/M_AXIMM] [get_bd_addr_segs hmss_0/S00_AXI/HBM_MEM15]
assign_bd_address -offset 0x0000000100000000 -range 256M -target_address_space [get_bd_addr_spaces static_region/sim_xdma_0/M_AXIMM] [get_bd_addr_segs hmss_0/S00_AXI/HBM_MEM16]
assign_bd_address -offset 0x0000000110000000 -range 256M -target_address_space [get_bd_addr_spaces static_region/sim_xdma_0/M_AXIMM] [get_bd_addr_segs hmss_0/S00_AXI/HBM_MEM17]
assign_bd_address -offset 0x0000000120000000 -range 256M -target_address_space [get_bd_addr_spaces static_region/sim_xdma_0/M_AXIMM] [get_bd_addr_segs hmss_0/S00_AXI/HBM_MEM18]
assign_bd_address -offset 0x0000000130000000 -range 256M -target_address_space [get_bd_addr_spaces static_region/sim_xdma_0/M_AXIMM] [get_bd_addr_segs hmss_0/S00_AXI/HBM_MEM19]
assign_bd_address -offset 0x0000000140000000 -range 256M -target_address_space [get_bd_addr_spaces static_region/sim_xdma_0/M_AXIMM] [get_bd_addr_segs hmss_0/S00_AXI/HBM_MEM20]
assign_bd_address -offset 0x0000000150000000 -range 256M -target_address_space [get_bd_addr_spaces static_region/sim_xdma_0/M_AXIMM] [get_bd_addr_segs hmss_0/S00_AXI/HBM_MEM21]
assign_bd_address -offset 0x0000000160000000 -range 256M -target_address_space [get_bd_addr_spaces static_region/sim_xdma_0/M_AXIMM] [get_bd_addr_segs hmss_0/S00_AXI/HBM_MEM22]
assign_bd_address -offset 0x0000000170000000 -range 256M -target_address_space [get_bd_addr_spaces static_region/sim_xdma_0/M_AXIMM] [get_bd_addr_segs hmss_0/S00_AXI/HBM_MEM23]
assign_bd_address -offset 0x0000000180000000 -range 256M -target_address_space [get_bd_addr_spaces static_region/sim_xdma_0/M_AXIMM] [get_bd_addr_segs hmss_0/S00_AXI/HBM_MEM24]
assign_bd_address -offset 0x0000000190000000 -range 256M -target_address_space [get_bd_addr_spaces static_region/sim_xdma_0/M_AXIMM] [get_bd_addr_segs hmss_0/S00_AXI/HBM_MEM25]
assign_bd_address -offset 0x00000001A0000000 -range 256M -target_address_space [get_bd_addr_spaces static_region/sim_xdma_0/M_AXIMM] [get_bd_addr_segs hmss_0/S00_AXI/HBM_MEM26]
assign_bd_address -offset 0x00000001B0000000 -range 256M -target_address_space [get_bd_addr_spaces static_region/sim_xdma_0/M_AXIMM] [get_bd_addr_segs hmss_0/S00_AXI/HBM_MEM27]
assign_bd_address -offset 0x00000001C0000000 -range 256M -target_address_space [get_bd_addr_spaces static_region/sim_xdma_0/M_AXIMM] [get_bd_addr_segs hmss_0/S00_AXI/HBM_MEM28]
assign_bd_address -offset 0x00000001D0000000 -range 256M -target_address_space [get_bd_addr_spaces static_region/sim_xdma_0/M_AXIMM] [get_bd_addr_segs hmss_0/S00_AXI/HBM_MEM29]
assign_bd_address -offset 0x00000001E0000000 -range 256M -target_address_space [get_bd_addr_spaces static_region/sim_xdma_0/M_AXIMM] [get_bd_addr_segs hmss_0/S00_AXI/HBM_MEM30]
assign_bd_address -offset 0x00000001F0000000 -range 256M -target_address_space [get_bd_addr_spaces static_region/sim_xdma_0/M_AXIMM] [get_bd_addr_segs hmss_0/S00_AXI/HBM_MEM31]
assign_bd_address -offset 0x0000000200000000 -range 128K -target_address_space [get_bd_addr_spaces static_region/sim_xdma_0/M_AXIMM] [get_bd_addr_segs memory_subsystem/S00_AXI/PLRAM_MEM00]
assign_bd_address -offset 0x0000000200400000 -range 128K -target_address_space [get_bd_addr_spaces static_region/sim_xdma_0/M_AXIMM] [get_bd_addr_segs memory_subsystem/S00_AXI/PLRAM_MEM01]
assign_bd_address -offset 0x0000000201000000 -range 128K -target_address_space [get_bd_addr_spaces static_region/sim_xdma_0/M_AXIMM] [get_bd_addr_segs memory_subsystem/S00_AXI/PLRAM_MEM02]
assign_bd_address -offset 0x0000000201400000 -range 128K -target_address_space [get_bd_addr_spaces static_region/sim_xdma_0/M_AXIMM] [get_bd_addr_segs memory_subsystem/S00_AXI/PLRAM_MEM03]

validate_bd_design
save_bd_design
